# EAGLE schematic scout_mk2 (EAGLE 7.1.0)
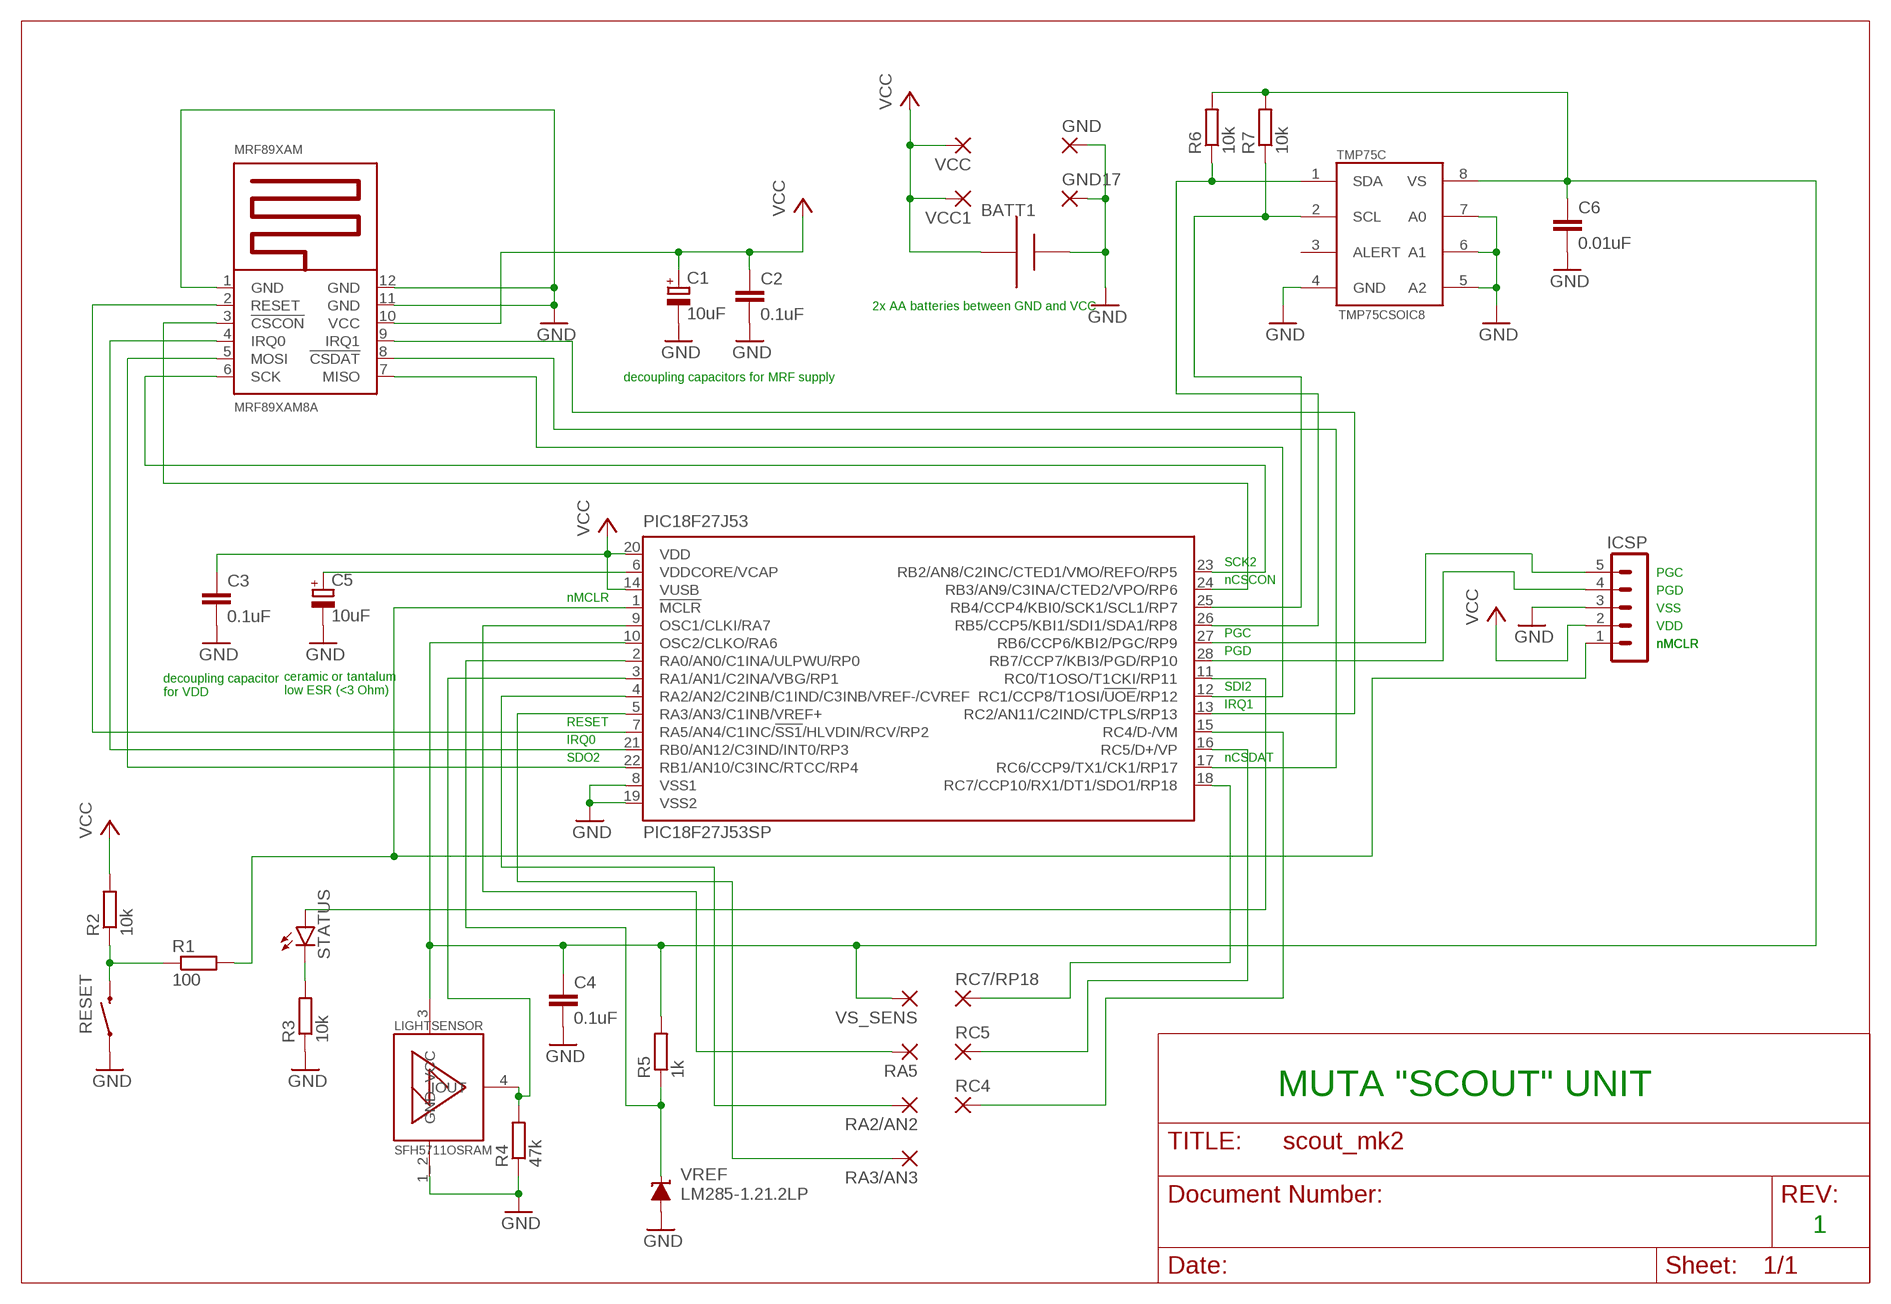
[diagram p0: schematic, sheet 1]

## Parts
BATT1  AAA  [2XAAA]
C1  10uF  CPOL-EUTT6D6  [TT5D6]
C2  0.1uF  C-EU050-025X075  [C050-025X075]
C3  0.1uF  C-EU050-025X075  [C050-025X075]
C4  0.1uF  C-EU050-025X075  [C050-025X075]
C5  10uF  CPOL-EUC/6032-28R  [C/6032-28R]
C6  0.01uF  C-EU050-025X075  [C050-025X075]
GND  3,81/1,1  [3,81/1,1]
GND17  3,81/1,1  [3,81/1,1]
ICSP  MA05-1  [MA05-1]
LIGHTSENSOR  SFH5711OSRAM  [SFH5711]
MRF89XAM  MRF89XAM8A  [MRF89XAMXA]
PIC18F27J53  PIC18F27J53SP  [DIL28-3]
R1  100  R-EU_0207_10  [0207/10]
R2  10k  R-EU_0207_10  [0207/10]
R3  10k  R-EU_0207_2V  [0207/2V]
R4  47k  R-EU_0207_10  [0207/10]
R5  1k  R-EU_0207_10  [0207/10]
R6  10k  R-EU_0207_10  [0207/10]
R7  10k  R-EU_0207_10  [0207/10]
RA2/AN2  3,81/1,1  [3,81/1,1]
RA3/AN3  3,81/1,1  [3,81/1,1]
RA5  3,81/1,1  [3,81/1,1]
RC4  3,81/1,1  [3,81/1,1]
RC5  3,81/1,1  [3,81/1,1]
RC7/RP18  3,81/1,1  [3,81/1,1]
RESET  SWITCH-MOMENTARY-2PTH  [TACTILE-PTH]
STATUS  LED1206  [LED-1206]
TMP75C  TMP75CSOIC8  [SOIC8]
VCC  3,81/1,1  [3,81/1,1]
VCC1  3,81/1,1  [3,81/1,1]
VREF  LM285-1.21.2LP  [LP_O-PBCY-W3]
VS_SENS  3,81/1,1  [3,81/1,1]

## Nets
GND: BATT1.P$1(+) C1.- C2.2 C3.2 C4.2 C5.- C6.2 GND17.1(P) GND.1(P) ICSP.3 LIGHTSENSOR.1_2(GND) MRF89XAM.1(GND) MRF89XAM.11(GND) MRF89XAM.12(GND) PIC18F27J53.8(VSS1) PIC18F27J53.19(VSS2) R3.1 R4.1 RESET.1 TMP75C.4(GND) TMP75C.5(A2) TMP75C.6(A1) TMP75C.7(A0) VREF.3(A)
N$2: LIGHTSENSOR.4(IOUT) PIC18F27J53.3(RA1/AN1/C2INA/VBG/RP1) R4.2
N$3: ICSP.1 PIC18F27J53.1(!MCLR) R1.2
N$4: C5.+ PIC18F27J53.6(VDDCORE/VCAP)
N$5: R1.1 R2.1 RESET.3
N$6: ICSP.4 PIC18F27J53.28(RB7/CCP7/KBI3/PGD/RP10)
N$7: ICSP.5 PIC18F27J53.27(RB6/CCP6/KBI2/PGC/RP9)
N$8: PIC18F27J53.2(RA0/AN0/C1INA/ULPWU/RP0) R5.1 VREF.2(C)
N$9: MRF89XAM.2(RESET) PIC18F27J53.7(RA5/AN4/C1INC/!SS1!/HLVDIN/RCV/RP2)
N$10: MRF89XAM.6(SCK) PIC18F27J53.23(RB2/AN8/C2INC/CTED1/VMO/REFO/RP5)
N$11: PIC18F27J53.26(RB5/CCP5/KBI1/SDI1/SDA1/RP8) R6.1 TMP75C.1(SDA)
N$12: PIC18F27J53.25(RB4/CCP4/KBI0/SCK1/SCL1/RP7) R7.1 TMP75C.2(SCL)
N$13: PIC18F27J53.9(OSC1/CLKI/RA7) RA5.1(P)
N$14: R3.2 STATUS.C
N$15: PIC18F27J53.11(RC0/T1OSO/T1CKI/RP11) STATUS.A
N$16: PIC18F27J53.4(RA2/AN2/C2INB/C1IND/C3INB/VREF-/CVREF) RA2/AN2.1(P)
N$17: PIC18F27J53.5(RA3/AN3/C1INB/VREF+) RA3/AN3.1(P)
N$19: MRF89XAM.7(MISO) PIC18F27J53.12(RC1/CCP8/T1OSI/!UOE!/RP12)
N$21: MRF89XAM.3(!CSCON) PIC18F27J53.24(RB3/AN9/C3INA/CTED2/VPO/RP6)
N$22: MRF89XAM.5(MOSI) PIC18F27J53.22(RB1/AN10/C3INC/RTCC/RP4)
N$23: MRF89XAM.4(IRQ0) PIC18F27J53.21(RB0/AN12/C3IND/INT0/RP3)
N$24: MRF89XAM.9(IRQ1) PIC18F27J53.13(RC2/AN11/C2IND/CTPLS/RP13)
N$25: MRF89XAM.8(!CSDAT) PIC18F27J53.17(RC6/CCP9/TX1/CK1/RP17)
N$26: PIC18F27J53.18(RC7/CCP10/RX1/DT1/SDO1/RP18) RC7/RP18.1(P)
N$27: PIC18F27J53.16(RC5/D+/VP) RC5.1(P)
N$28: PIC18F27J53.15(RC4/D-/VM) RC4.1(P)
N$29: C4.1 C6.1 LIGHTSENSOR.3(VCC) PIC18F27J53.10(OSC2/CLKO/RA6) R5.2 R6.2 R7.2 TMP75C.8(VS) VS_SENS.1(P)
VCC: BATT1.P$2(-) C1.+ C2.1 C3.1 ICSP.2 MRF89XAM.10(VCC) PIC18F27J53.14(VUSB) PIC18F27J53.20(VDD) R2.2 VCC1.1(P) VCC.1(P)
Unconnected: TMP75C.3(ALERT)

## Notes on the sheet
- 2x AA batteries between GND and VCC
- decoupling capacitors for MRF supply
- SCK2
- PGC
- nCSCON
- PGD
- nMCLR
- VSS
- VDD
- PGC
- nMCLR | nMCLR
- PGD
- SDI2
- ceramic or tantalum
  low ESR (<3 Ohm)
- decoupling capacitor
  for VDD
- IRQ1
- RESET
- IRQ0
- SDO2 | nCSDAT
- MUTA "SCOUT" UNIT
- 1

## Library data of the parts
BATT1 = nio:AAA: AAA PC pin holder Mouser part #12BH412 - but pretty much any 1x AAA battery holder should be the same http://www.ladyada.net/library/pcb/eaglelibrary.html
C1 C5 = resistor:CPOL-EU: POLARIZED CAPACITOR, European symbol
C2-C4 C6 = rcl:C-EU: CAPACITOR, European symbol
GND GND17 RA2/AN2 RA3/AN3 RA5 RC4 RC5 RC7/RP18 VCC VCC1 VS_SENS = wirepad:3,81/1,1: THROUGH-HOLE PAD
ICSP = con-lstb:MA05-1: PIN HEADER; OC_FARNELL: unknown; OC_NEWARK: unknown
LIGHTSENSOR = nio:SFH5711
MRF89XAM = microchip2:MRF89XAM8A: Microchip MRF89XAM8A 868MHz Module
PIC18F27J53 = microchip:PIC18F2*J53: PIC18F47J53 Family High-Performance USB Microcontrollers with nanoWatt XLP Technology Source: Data sheet <http://ww1.microchip.com/downloads/en/DeviceDoc/39964B.pdf>; MPN: PIC18F27J53-I/SP; OC_FARNELL: unknown; OC_NEWARK: 63R7839
R1-R7 = resistor:R-EU_: RESISTOR, European symbol; SPICEPREFIX: R
RESET = SparkFun-Electromechanical:SWITCH-MOMENTARY-2: Various NO switches- pushbuttons, reed, etc
STATUS = SparkFun-LED:LED: LEDs Standard schematic elements and footprints for 5mm, 3mm, 1206, and 0603 sized LEDs. 5mm - Spark Fun Electronics SKU : COM-00529 (and others)
TMP75C = nio:TMP75C
VREF = texas:LM285-1.2